# Altium project smartparks-elephant-lora.PrjPCB
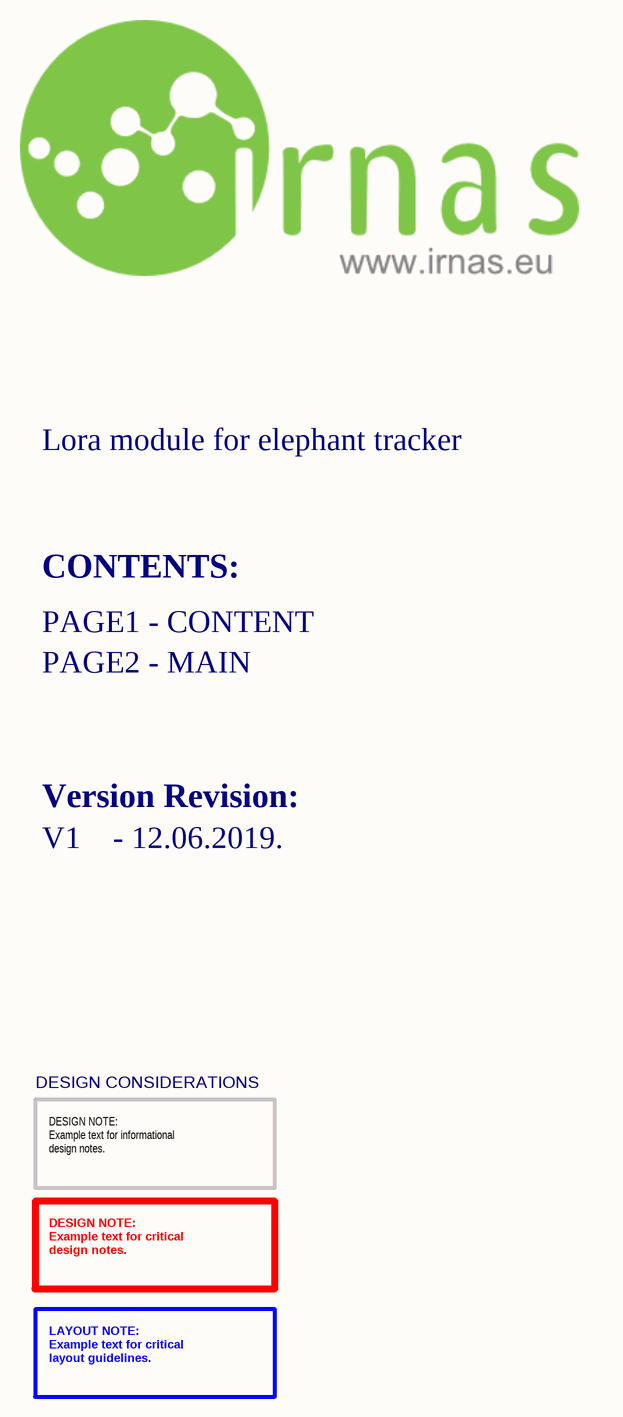
[diagram p0: PAGE1-CONTENT.SchDoc]
Company: IRNAS; CreateDate: dd.mm.yyyy; PCBDesigner: Vojislav Milivojevic; ProjectTitle: SmartParks Elephant LoRa; RevisionDate: dd.mm.yyyy; Version: V1; Website: www.irnas.eu
2 sheets, 40 parts. Net scope: global (net labels, ports and power ports of the same name join across sheets).
Board file: MAIN.PcbDoc
Sheets:
  PAGE1-CONTENT.SchDoc
  PAGE2-MAIN.SchDoc

## Sheet PAGE1-CONTENT.SchDoc
size A3; DocumentNumber: 1; SheetNumber: 1; SheetTotal: 2

### Notes on the sheet
- Lora module for elephant tracker
- CONTENTS:
- PAGE1 - CONTENT
- PAGE2 - MAIN
- Version Revision:
- V1    - 12.06.2019.
- DESIGN CONSIDERATIONS
- DESIGN NOTE:
  Example text for informational
  design notes.
- DESIGN NOTE:
  Example text for critical
  design notes.
- LAYOUT NOTE:
  Example text for critical
  layout guidelines.
- Size: A3
- Revision:
- Sheet
- of

## Sheet PAGE2-MAIN.SchDoc
size A3; DocumentNumber: 2; SheetNumber: 2; SheetTotal: 2
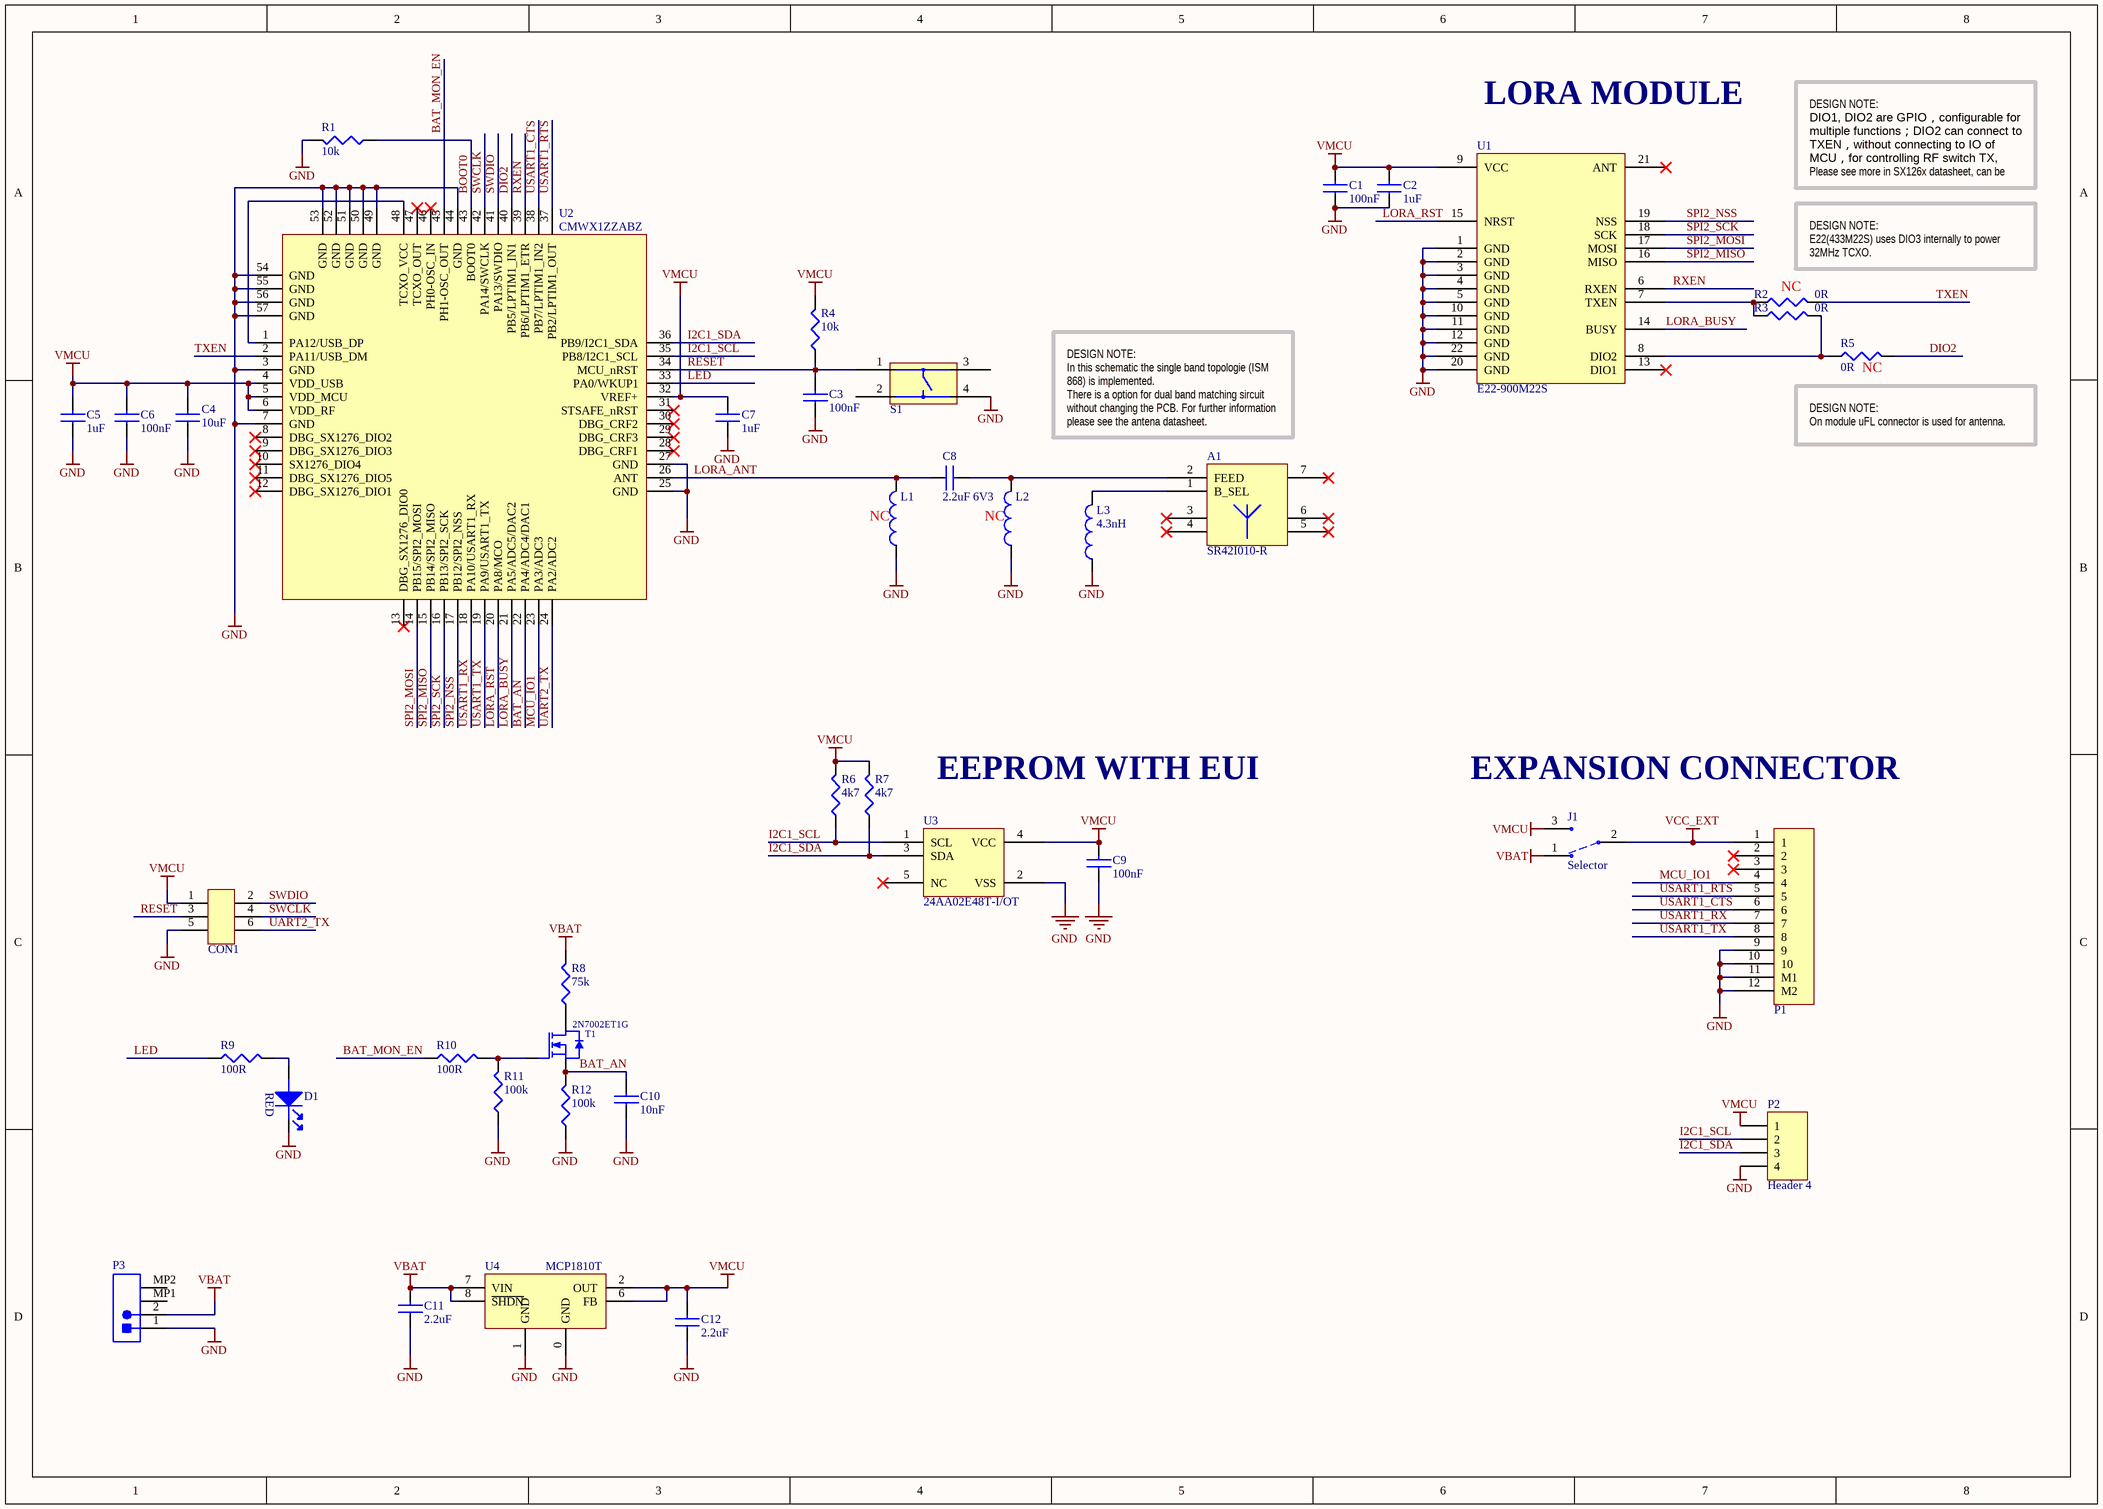
[diagram p1: PAGE2-MAIN.SchDoc]

### Parts
A1  SR42I010-R  [LORA_PCB_ANTENNA]
C1  100nF  [CAP0603]
C2  1uF  [CAP0603]
C3  100nF  [CAP0603]
C4  10uF  [CAP0603]
C5  1uF  [CAP0603]
C6  100nF  [CAP0603]
C7  1uF  [CAP0603]
C8  2.2uF 6V3  [CAP0402]
C9  100nF  [CAP0603]
C10  10nF  [CAP0603]
C11  2.2uF  [CAP0805]
C12  2.2uF  [CAP0805]
CON1  Tag connect  [TC2030-IDC-NL]  (value not drawn)  (no BOM)
D1  LED RED  [LED0603]  (value not drawn)
J1  Selector  [Selector]
L1  4.3nH  [IND0402]  (value not drawn)
L2  4.3nH  [IND0402]  (value not drawn)
L3  4.3nH  [IND0402]
P1  53261-1071  [53261-1071]  (value not drawn)
P2  Header 4  [HDR1X4]
P3  S2B-PH-SM4-TB(LF)(SN)  [JST- S2B-PH-SM4-TB(LF)(SN)-2_V]  (value not drawn)
R1  10k  [RES0603]
R2  0R  [RES0603]
R3  0R  [RES0603]
R4  10k  [RES0603]
R5  0R  [RES0603]
R6  4k7  [RES0603]
R7  4k7  [RES0603]
R8  75k  [RES0603]
R9  100R  [RES0603]
R10  100R  [RES0603]
R11  100k  [RES0603]
R12  100k  [RES0603]
S1  KMR221NGLFS  [SW]  (value not drawn)
T1  2N7002ET1G  [SOT23-3AL]
U1  E22-900M22S  [E22-900M22S]
U2  CMWX1ZZABZ  [Lora Module ES0]
U3  24AA02E48T-I/OT  [SOT95P280X145-5N]
U4  MCP1810T  [VDFN_2x2]

### Nets
GND: C1.1 C2.1 C3.1 C4.1 C5.1 C6.1 C7.1 C9.1 C10.1 C11.1 C12.1 CON1.5 D1.1(cathode) L1.1 L2.1 L3.1 P1.9 P1.10 P1.11(M1) P1.12(M2) P2.4 P3.1 R1.2 R11.1 R12.1 S1.4 U1.1(GND) U1.2(GND) U1.3(GND) U1.4(GND) U1.5(GND) U1.10(GND) U1.11(GND) U1.12(GND) U1.20(GND) U1.22(GND) U2.3(GND) U2.7(GND) U2.25(GND) U2.27(GND) U2.44(GND) U2.49(GND) U2.50(GND) U2.51(GND) U2.52(GND) U2.53(GND) U2.54(GND) U2.55(GND) U2.56(GND) U2.57(GND) U3.2(VSS) U4.0(GND) U4.1(GND)
VBAT: C11.2 J1.1 P3.2 R8.2 U4.7(VIN) U4.8(~{SHDN})
VCC_EXT: J1.2 P1.1
VMCU: C1.2 C2.2 C4.2 C5.2 C6.2 C7.2 C9.2 C12.2 CON1.1 J1.3 P2.1 R4.2 R6.2 R7.2 U1.9(VCC) U2.4(VDD_USB) U2.5(VDD_MCU) U2.6(VDD_RF) U2.32(VREF+) U3.4(VCC) U4.2(OUT) U4.6(FB)
BAT_AN: C10.2 R12.2 T1.2(S) U2.22(PA4/ADC4/DAC1)
BAT_MON_EN: R10.1 U2.45(PH1-OSC_OUT)
BOOT0: R1.1 U2.43(BOOT0)
DIO2: R5.2 U2.40(PB5/LPTIM1_IN1)
I2C1_SCL: P2.2 R6.1 U2.35(PB8/I2C1_SCL) U3.1(SCL)
I2C1_SDA: P2.3 R7.1 U2.36(PB9/I2C1_SDA) U3.3(SDA)
LED: R9.1 U2.33(PA0/WKUP1)
LORA_ANT: C8.1 L1.2 U2.26(ANT)
LORA_BUSY: U1.14(BUSY) U2.21(PA5/ADC5/DAC2)
LORA_RST: U1.15(NRST) U2.20(PA8/MCO)
MCU_IO1: P1.4 U2.23(PA3/ADC3)
RESET: C3.2 CON1.3 R4.1 S1.1 U2.34(MCU_nRST)
RXEN: U1.6(RXEN) U2.39(PB6/LPTIM1_ETR)
SPI2_MISO: U1.16(MISO) U2.15(PB14/SPI2_MISO)
SPI2_MOSI: U1.17(MOSI) U2.14(PB15/SPI2_MOSI)
SPI2_NSS: U1.19(NSS) U2.17(PB12/SPI2_NSS)
SPI2_SCK: U1.18(SCK) U2.16(PB13/SPI2_SCK)
SWCLK: CON1.4 U2.42(PA14/SWCLK)
SWDIO: CON1.2 U2.41(PA13/SWDIO)
TXEN: R2.2 U2.2(PA11/USB_DM)
UART2_TX: CON1.6 U2.24(PA2/ADC2)
USART1_CTS: P1.6 U2.38(PB7/LPTIM1_IN2)
USART1_RTS: P1.5 U2.37(PB2/LPTIM1_OUT)
USART1_RX: P1.7 U2.18(PA10/USART1_RX)
USART1_TX: P1.8 U2.19(PA9/USART1_TX)
NetA1_1: A1.1(B_SEL) L3.2
NetA1_2: A1.2(FEED) C8.2 L2.2
NetD1_2: D1.2(ANODE) R9.2
NetR2_1: R2.1 R3.1 U1.7(TXEN)
NetR3_2: R3.2 R5.1 U1.8(DIO2)
NetR8_1: R8.1 T1.3(D)
NetR10_2: R10.2 R11.2 T1.1(G)
NetU2_1: U2.1(PA12/USB_DP) U2.48(TCXO_VCC)

Not connected (* = marked no-connect by the designer): A1 3* 4* 5* 6* 7*; P1 2* 3*; P3 MP1 MP2; S1 2 3; U1 13(DIO1)* 21(ANT)*; U2 8(DBG_SX1276_DIO2)* 9(DBG_SX1276_DIO3)* 10(SX1276_DIO4)* 11(DBG_SX1276_DIO5)* 12(DBG_SX1276_DIO1)* 13(DBG_SX1276_DIO0)* 28(DBG_CRF1)* 29(DBG_CRF3)* 30(DBG_CRF2)* 31(STSAFE_nRST)* 46(PH0-OSC_IN)* 47(TCXO_OUT)*; U3 5(NC)*

### Notes on the sheet
- LORA MODULE
- DESIGN NOTE:
  DIO1, DIO2 are GPIO，configurable for multiple functions；DIO2 can connect to TXEN，without connecting to IO of MCU，for controlling RF switch TX, Please see more in SX126x datasheet, can be floated when free.
- (near R2) NC
- DESIGN NOTE:
  E22(433M22S) uses DIO3 internally to power 32MHz TCXO.
- (near R5) NC
- DESIGN NOTE:
  In this schematic the single band topologie (ISM 868) is implemented.
  There is a option for dual band matching sircuit without changing the PCB. For further information please see the antena datasheet.
- (near R5) DESIGN NOTE:
  On module uFL connector is used for antenna.
- (near L1) NC
- (near L2) NC
- EEPROM WITH EUI
- EXPANSION CONNECTOR
- (in symbol LED - LED RED) RED

### Library data of the parts
A1 = SR42I010-R: Antenna SMD -4dBi Gain 870MHz/928MHz Automotive 7-Pin SMD T/R; Manufacturer: Antenova; Supplier 1: Mouser; Manufacturer Part Number: SR42I010-R; Stock 1: 3154; Pricing 1: 1 = 2.36000, 10 = 1.90000, 50 = 1.90000, 100 = 1.52000, 1000 = 1.07000, 10000 = 0.95900 (USD); Supplier Part Number 1: 237-SR42I010-R
C1 C3 C6 C9 = C - 100nF: MURATA - GRM188R71C104KA01J - CAP, MLCC, X7R, 0.1UF, 16V, 0603; IRNAS Part No.: I-200005; Ceramic Capacitor Case: 0603 [1608 Metric]; Capacitance: 0.1; Voltage Rating: 16; Capacitance Tolerance: ± 10%; Dielectric Characteristic: X7; Product Range: GRM Series; SVHC: No SVHC (20-Jun-2016; Supplier 1: Farnell; Manufacturer: MURATA; Manufacturer Part Number: GRM188R71C104KA01J; RoHS: YES; Stock 1: 18297; Pricing 1: 10=0.0145, 100=0.0126, 500=0.0081, 2500=0.0059, 5000=0.0052, 10000=0.0046, 50000=0.0036, 100000=0.0035 (GBP); Packaging: Cut Tape; Operating Temperature Min: -55; Operating Temperature Max: 125; Automotive Qualification Standard: -; MSL: MSL 1 - Unlimited; ComponentLink1URL: http://www.farnell.com/datasheets/2189124.pdf; ComponentLink1Description: http://www.farnell.com/datasheets/2189124.pdf; Supplier Part Number 1: 2688519
C2 C5 C7 = C - 1uF: MURATA - GRM188R61H105KAALD - CAP, MLCC, X5R, 1UF, 50V, 0603; IRNAS Part No.: I-200006; Ceramic Capacitor Case: 0603 [1608 Metric]; Capacitance: 1; Voltage Rating: 50; Capacitance Tolerance: ± 10%; Dielectric Characteristic: X5; Product Range: GRM Series; SVHC: No SVHC (17-Dec-2015); Capacitor Terminals: SMD<!--FANDB--><div class="features-and-benefits-container"><div class="features-and-benefits-description"><span class="features-benefits-value">The Murata GRM series capacitors are Multilayer Ceramic Chip Capacitors (MLCC) used for general purpose applications. These MLCC capacitors are classified into temperature compensating and high dielectric constant types depending on the change in electrostatic capacitance due to change in temperature. The temperature compensating capacitors feature a small rate of change in electrostatic capacitance as the temperature changes and are used for applications such as filters and high frequency circuit matching. The high dielectric constant capacitors use materials with a high dielectric constant and feature a large electrostatic capacitance. Typical applications are power supply decoupling and smoothing circuits.</span></div><div class="features-and-benefits-list"><ul class="features-and-benefits-list-list"><li class="features-and-benefits-list-item">Large capacity and small size in a multilayer structure</li><li class="features-and-benefits-list-item">Capacitance value ranging from 0.1pF to 220?F</li><li class="features-and-benefits-list-item">Tin plated external electrodes, excellent solderability</li><li class="features-and-benefits-list-item">Provides good high frequency characteristics</li><li class="features-and-benefits-list-item">Excellent pulse response</li><li class="features-and-benefits-list-item">High reliability</li><li class="features-and-benefits-list-item">Capacitor size varies from 0.4×0.2mm to 5.7×5.0mm</li><li class="features-and-benefits-list-item">Rated voltage of 2.5VDC to 3.15; Supplier 1: Farnell; Manufacturer: MURATA; Manufacturer Part Number: GRM188R61H105KAALD; RoHS: YES; Stock 1: 62682; Pricing 1: 10=0.093, 100=0.062, 500=0.0507, 1000=0.0465, 2000=0.0429, 4000=0.0399, 20000=0.0372, 40000=0.0365 (GBP); Packaging: Cut Tape; Operating Temperature Min: -55; Operating Temperature Max: 85; Automotive Qualification Standard: -; MSL: -; Capacitance Tolerance ±: ± 10%; ComponentLink1URL: http://www.farnell.com/datasheets/2048611.pdf; ComponentLink1Description: http://www.farnell.com/datasheets/2048611.pdf; Supplier Part Number 1: 1845736
C4 = 10uF: 10uf/0603/20%; Manufacturer: KEMET; Manufacturer Part Number: C0603C106M8PACTU; Stock 1: 0; Pricing 1: 10=0.555, 100=0.315, 500=0.238, 1000=0.2, 2000=0.174, 4000=0.143, 20000=0.123 (GBP); Supplier 1: Farnell; Supplier Part Number 1: 2456110
C8 = C - 2.2uF/6V3/0402: CAP CER 2.2UF 6.3V 20% X5R 0402; Manufacturer: Murata; Manufacturer Part Number: GRM155R60J225ME15D; IRNAS Part No.: /; Material: Ceramic; Supplier 1: Farnell; Stock 1: 0; Pricing 1: 10=0.118, 100=0.0494, 500=0.031, 2500=0.0213, 5000=0.0163 (EUR); Mount: Surface Mount; Case/Package: 0402; Case Code (Metric): 1005; Case Code (Imperial): 0402; Min Operating Temperature: -55°C; Max Operating Temperature: 85°C; Packaging: Tape and Reel; Capacitance: 2.2uF; Tolerance: 20%; Package Quantity: 10000; Voltage Rating: 6.3V; Voltage Rating (DC): 6.3V; Dielectric: X5R; Termination: SMD/SMT; Voltage: 6.3V; Length: 1mm; Height: 0.5mm; Width: 0.02inch; Thickness: 0.022inch; Depth: 0.5mm; Radiation Hardening: No; REACH SVHC: No SVHC; Lead Free: Lead Free; ComponentLink1URL: https://datasheet.ciiva.com/29149/450128-da-01-de-vs-kondens-grm155-r60j-225me15d-29149006.pdf; ComponentLink1Description: https://datasheet.ciiva.com/29149/450128-da-01-de-vs-kondens-grm155-r60j-225me15d-29149006.pdf; ComponentLink2URL: https://datasheet.ciiva.com/46418/1754686-46418042.pdf; ComponentLink2Description: https://datasheet.ciiva.com/46418/1754686-46418042.pdf; ComponentLink3URL: https://datasheet.ciiva.com/17454/c02e-17454956.pdf; ComponentLink3Description: https://datasheet.ciiva.com/17454/c02e-17454956.pdf; ComponentLink4URL: https://datasheet.ciiva.com/235/partnumbering-e-01-235009.pdf; ComponentLink4Description: https://datasheet.ciiva.com/235/partnumbering-e-01-235009.pdf; ComponentLink5URL: https://datasheet.ciiva.com/2989/c02e-2989361.pdf; ComponentLink5Description: https://datasheet.ciiva.com/2989/c02e-2989361.pdf; ComponentLink6URL: https://datasheet.ciiva.com/235/partnumbering-e-01-235010.pdf; ComponentLink6Description: https://datasheet.ciiva.com/235/partnumbering-e-01-235010.pdf; ComponentLink7URL: https://datasheet.ciiva.com/235/partnumbering-e-01-235011.pdf; ComponentLink7Description: https://datasheet.ciiva.com/235/partnumbering-e-01-235011.pdf; Supplier Part Number 1: 2362088
C10 = C - 10nF: KEMET - C0603X103K5RECAUTO - CAP, MLCC, AEC-Q200, X7R, 0.01UF, 50V; Manufacturer: TDK EPCOS; IRNAS Part No.: I-200004; Supplier 1: Farnell; Manufacturer Part Number: C0603X103K5RECAUTO; Stock 1: 307350; Pricing 1: 10=0.133, 100=0.0731, 500=0.055, 1000=0.0465, 2000=0.0408, 4000=0.0336, 20000=0.0295 (GBP); ComponentLink1URL: http://www.farnell.com/datasheets/2290180.pdf; ComponentLink1Description: http://www.farnell.com/datasheets/2290180.pdf; Supplier Part Number 1: 2760492
C11 C12 = C - 2.2uF/0805: Multilayer Ceramic Capacitors MLCC - SMD/SMT 2.2uF 25V X7R 10%; Manufacturer: Yageo; Manufacturer Part Number: CC0805KKX7R8BB225; IRNAS Part No.: /; Supplier 1: Farnell; Stock 1: 0; Pricing 1: 5=0.269, 50=0.163, 250=0.109, 500=0.0929, 1500=0.0722, 3000=0.0594, 15000=0.05 (GBP); Mount: Surface Mount; Case/Package: 0805; Number of Pins: 2; Case Code (Imperial): 0805; Case Code (Metric): 2012; Min Operating Temperature: -55°C; Max Operating Temperature: 125°C; Packaging: Tape and Reel; Voltage Rating: 25V; Voltage Rating (DC): 25V; Tolerance: 10%; Capacitance: 2.2uF; Dielectric: X7R; Termination: SMD/SMT; Composition: Ceramic; Length: 2mm; Height: 0.3mm; Depth: 1.25mm; Width: 1.25mm; Thickness: 0.057inch; Radiation Hardening: No; REACH SVHC: Unknown; Lead Free: Lead Free; Halogen Free: Halogen Free; ComponentLink1URL: https://datasheet.ciiva.com/7009/775840-7009706.pdf; ComponentLink1Description: https://datasheet.ciiva.com/7009/775840-7009706.pdf; Supplier Part Number 1: 1458904
CON1 = tag connecot 6 pin
D1 = LED - LED RED: BROADCOM LIMITED - HSMS-C190 - LED, RED, 10MCD, 626NM; LED Mounting: SMD; Forward Current If: 20; Forward Voltage: 2.1; Wavelength Typ: 626; Luminous Intensity: 10; Viewing Angle: 170°; Lens Shape: Rectangular; SVHC: No SVHC (17-Dec-2015)<!--FANDB--><div class="features-and-benefits-container"><div class="features-and-benefits-description"><span class="features-benefits-value">The HSMS-C190 is a HER SMD Chip LED with untinted/diffused lens, made of GaP. It is designed in an industry standard package 1.6 x 0.8mm footprint with 0.8mm profile. It is compatible with IR reflow solder processes. The small size and wide viewing angle make this LED prime choices for backlighting applications and front panel illumination especially where space is a premium.</span></div><div class="features-and-benefits-list"><ul class="features-and-benefits-list-list"><li class="features-and-benefits-list-item">Small size</li><li class="features-and-benefits-list-item">Industry standard footprint</li><li class="features-and-benefits-list-item">Compatible with IR solder</li><li class="features-and-benefits-list-item">Diffused optics</li><li class="features-and-benefits-list-item">-40 to 85; Supplier 1: Farnell; Manufacturer: BROADCOM LIMITED; Manufacturer Part Number: HSMS-C190; RoHS: YES; Stock 1: 7534; Pricing 1: 1=0.361, 10=0.256, 50=0.235, 100=0.106, 200=0.101 (GBP); LED Colour: Red; Bulb Size: -; Packaging: Cut Tape; Product Range: -; Automotive Qualification Standard: -; MSL: -; ComponentLink1URL: http://www.farnell.com/datasheets/313031.pdf; ComponentLink1Description: http://www.farnell.com/datasheets/313031.pdf; ComponentLink2URL: http://www.farnell.com/datasheets/1681524.pdf; ComponentLink2Description: http://www.farnell.com/datasheets/1681524.pdf; ComponentLink3URL: http://www.farnell.com/datasheets/2165483.pdf; ComponentLink3Description: http://www.farnell.com/datasheets/2165483.pdf; Supplier Part Number 1: 2497356
L1 L2 = L - 4.3nH/0402: Inductor RF Chip Multi-Layer 4.3nH 0.3nH 100MHz 8Q-Factor Air 300mA 210mOhm DCR 0402 Paper T/R; Manufacturer: Murata; Manufacturer Part Number: LQG15HN4N3S02D; IRNAS Part No.: /; Q Factor: 8; Self Resonant Frequency: 6GHz; Shielding: Unshielded; DC Resistance (DCR): 210mR; Supplier 1: Digi-Key; Stock 1: 3502; Pricing 1: 1 = 0.10000, 10 = 0.06100, 100 = 0.04040, 500 = 0.03366, 1000 = 0.02827, 2500 = 0.02423 (USD); RoHS: Yes; Mount: Surface Mount; Case/Package: 0402; Core Material: Air; Case Code (Metric): 1005; Case Code (Imperial): 0402; Min Operating Temperature: -55°C; Max Operating Temperature: 125°C; Package Quantity: 10000; Packaging: Tape and Reel; Current Rating: 300mA; Inductance: 4.3nh; Test Frequency: 100MHz; Max DC Current: 300mA; Termination: SMD/SMT; Current: 300mA; DC Current: 300mA; Military Standard: Not; Length: 1.05mm; Height: 0.5mm; Width: 0.02inch; Height - Seated (Max): 0.022inch; Depth: 0.55mm; Radiation Hardening: No; REACH SVHC: No SVHC; Lead Free: Lead Free; ComponentLink1URL: http://uk.rs-online.com/webdocs/0f10/0900766b80f10808.pdf?src-supplier=RSComponents; ComponentLink1Description: http://uk.rs-online.com/webdocs/0f10/0900766b80f10808.pdf?src-supplier=RSComponents; ComponentLink2URL: http://search.murata.co.jp/Ceramy/image/img/PDF/ENG/L0075S0083LQG15HN.pdf?src-supplier=Avnet; ComponentLink2Description: http://search.murata.co.jp/Ceramy/image/img/PDF/ENG/L0075S0083LQG15HN.pdf?src-supplier=Avnet; ComponentLink3URL: http://www.farnell.com/datasheets/66026.pdf?src-supplier=Element14; ComponentLink3Description: http://www.farnell.com/datasheets/66026.pdf?src-supplier=Element14; ComponentLink4URL: https://www.verical.com/server-webapp/html/getDatasheet?partID=31252&src-supplier=Verical; ComponentLink4Description: https://www.verical.com/server-webapp/html/getDatasheet?partID=31252&src-supplier=Verical; ComponentLink5URL: http://search.murata.co.jp/Ceramy/image/img/PDF/ENG/L0075S0083LQG15HN.pdf?src-supplier=Avnet+Europe; ComponentLink5Description: http://search.murata.co.jp/Ceramy/image/img/PDF/ENG/L0075S0083LQG15HN.pdf?src-supplier=Avnet+Europe; ComponentLink6URL: https://search.murata.co.jp/Ceramy/image/img/P02/partnumberingAT_LQ3E.pdf?src-supplier=Digi-Key; ComponentLink6Description: https://search.murata.co.jp/Ceramy/image/img/P02/partnumberingAT_LQ3E.pdf?src-supplier=Digi-Key; Supplier Part Number 1: 490-6563-1-ND
L3 = 4.3nH/0402: Inductor RF Chip Multi-Layer 4.3nH 0.3nH 100MHz 8Q-Factor Air 300mA 210mOhm DCR 0402 Paper T/R; Manufacturer: Murata; Manufacturer Part Number: LQG15HN4N3S02D; Q Factor: 8; Self Resonant Frequency: 6GHz; Shielding: Unshielded; DC Resistance (DCR): 210mR; Supplier 1: Digi-Key; Stock 1: 3502; Pricing 1: 1 = 0.10000, 10 = 0.06100, 100 = 0.04040, 500 = 0.03366, 1000 = 0.02827, 2500 = 0.02423 (USD); RoHS: Yes; Mount: Surface Mount; Case/Package: 0402; Core Material: Air; Case Code (Metric): 1005; Case Code (Imperial): 0402; Min Operating Temperature: -55°C; Max Operating Temperature: 125°C; Package Quantity: 10000; Packaging: Tape and Reel; Current Rating: 300mA; Inductance: 4.3nh; Test Frequency: 100MHz; Max DC Current: 300mA; Termination: SMD/SMT; Current: 300mA; DC Current: 300mA; Military Standard: Not; Length: 1.05mm; Height: 0.5mm; Width: 0.02inch; Height - Seated (Max): 0.022inch; Depth: 0.55mm; Radiation Hardening: No; REACH SVHC: No SVHC; Lead Free: Lead Free; ComponentLink1URL: http://uk.rs-online.com/webdocs/0f10/0900766b80f10808.pdf?src-supplier=RSComponents; ComponentLink1Description: http://uk.rs-online.com/webdocs/0f10/0900766b80f10808.pdf?src-supplier=RSComponents; ComponentLink2URL: http://search.murata.co.jp/Ceramy/image/img/PDF/ENG/L0075S0083LQG15HN.pdf?src-supplier=Avnet; ComponentLink2Description: http://search.murata.co.jp/Ceramy/image/img/PDF/ENG/L0075S0083LQG15HN.pdf?src-supplier=Avnet; ComponentLink3URL: http://www.farnell.com/datasheets/66026.pdf?src-supplier=Element14; ComponentLink3Description: http://www.farnell.com/datasheets/66026.pdf?src-supplier=Element14; ComponentLink4URL: https://www.verical.com/server-webapp/html/getDatasheet?partID=31252&src-supplier=Verical; ComponentLink4Description: https://www.verical.com/server-webapp/html/getDatasheet?partID=31252&src-supplier=Verical; ComponentLink5URL: http://search.murata.co.jp/Ceramy/image/img/PDF/ENG/L0075S0083LQG15HN.pdf?src-supplier=Avnet+Europe; ComponentLink5Description: http://search.murata.co.jp/Ceramy/image/img/PDF/ENG/L0075S0083LQG15HN.pdf?src-supplier=Avnet+Europe; ComponentLink6URL: https://search.murata.co.jp/Ceramy/image/img/P02/partnumberingAT_LQ3E.pdf?src-supplier=Digi-Key; ComponentLink6Description: https://search.murata.co.jp/Ceramy/image/img/P02/partnumberingAT_LQ3E.pdf?src-supplier=Digi-Key; Supplier Part Number 1: 490-6563-1-ND
P1 = 53261-1071: Headers & Wire Housings 1.25MM HDR 10 CKT Right-Angle; Manufacturer: Molex; Contact Resistance: 20mR; Number of Positions: 10; Gender: Male; Voltage Rating: 125V; Current Rating: 1A; Insulation Resistance: 100MR; Glow Wire Compliant: Non-compliant; Supplier 1: Digi-Key; Manufacturer Part Number: 53261-1071; Stock 1: 12832; Pricing 1: 1 = 1.88000, 10 = 1.70200, 100 = 1.45900, 500 = 1.21584 (USD); RoHS: Yes; Mount: Surface Mount; Contact Plating: Tin; Contact Material: Bronze; Housing Material: Thermoplastic; Min Operating Temperature: -40°C; Max Operating Temperature: 85°C; Packaging: Tape and Reel; Orientation: Right Angle; Package Quantity: 1000; Termination: SMD/SMT; Number of Rows: 1; Number of Contacts: 10; Voltage Rating (DC): 125V; Number of Circuits: 10; Pitch: 1.25mm; Radiation Hardening: No; Lead Free: Lead Free; Flammability Rating: UL94 V-0; REACH SVHC: Unknown; ComponentLink1URL: https://datasheet.ciiva.com/7167/1626154-7167504.pdf?src-supplier=Newark; ComponentLink1Description: https://datasheet.ciiva.com/7167/1626154-7167504.pdf?src-supplier=Newark; ComponentLink2URL: https://datasheet.ciiva.com/5154/0532611071-pcb-headers-256967-5154836.pdf?src-supplier=Mouser; ComponentLink2Description: https://datasheet.ciiva.com/5154/0532611071-pcb-headers-256967-5154836.pdf?src-supplier=Mouser; ComponentLink3URL: https://datasheet.ciiva.com/7810/1597313-7810535.pdf?src-supplier=Element14; ComponentLink3Description: https://datasheet.ciiva.com/7810/1597313-7810535.pdf?src-supplier=Element14; ComponentLink4URL: https://datasheet.ciiva.com/27055/1932598-27055000.pdf?src-supplier=Jameco; ComponentLink4Description: https://datasheet.ciiva.com/27055/1932598-27055000.pdf?src-supplier=Jameco; ComponentLink5URL: https://datasheet.ciiva.com/11747/0900766b8078fc91-11747290.pdf?src-supplier=RSComponents; ComponentLink5Description: https://datasheet.ciiva.com/11747/0900766b8078fc91-11747290.pdf?src-supplier=RSComponents; ComponentLink6URL: https://datasheet.ciiva.com/46440/1808533-46440933.pdf?src-supplier=Element14; ComponentLink6Description: https://datasheet.ciiva.com/46440/1808533-46440933.pdf?src-supplier=Element14; ComponentLink7URL: https://datasheet.ciiva.com/46440/1626154-46440951.pdf?src-supplier=Element14; ComponentLink7Description: https://datasheet.ciiva.com/46440/1626154-46440951.pdf?src-supplier=Element14; Supplier Part Number 1: WM7628CT-ND
P2 = Header 4: Header, 4-Pin; LatestRevisionDate: 17-Jul-2002; LatestRevisionNote: Re-released for DXP Platform.; Publisher: Altium Limited
P3 = CMP-1755-00001-1: Male Header, Pitch 2 mm, 1 x 2 Position, Height 5.5 mm, -25 to 85 degC, RoHS, Tape and Reel; Current Rating: 3 A; ComponentLink1URL: http://www.jst.com/home2.html; Radiation Hardening: No; RoHSCompliant: True; Mount: Through Hole; Contact Material: Bronze; Package Quantity: 100; Width: 2.34 mm; DatasheetVersion: Dec-12; Height: 8.13 mm; Max Operating Temperature: 105degC; ComponentLink2Description: Datasheet; Lead Pitch: 0.1 inch; Contact Finish: Lead; Packaging: Bulk; Colour: Black; Contact Plating: Tin; Min Operating Temperature: -65degC; ComponentLink1Description: Manufacturer URL; PackageReference: S2B-PH-SM4-TB(LF)(SN)-2; PackageDescription: Male Header, Pitch 2 mm, 1 x 2 Position, Height 5.5 mm; ComponentLink2URL: http://www.jst-mfg.com/product/pdf/eng/ePH.pdf; Pins: 40; Length: 101.19 mm
R1 R4 = R - 10k: MULTICOMP - MCMR06X103 JTL - RES, CERAMIC, 10K, 5%, 0.1W, 0603; IRNAS Part No.: I-100008; Resistance: 10; Voltage Rating: 75; Resistor Case Style: 0603 [1608 Metric]; Power Rating: 100; Product Range: MCMR Series; Temperature Coefficient: ± 100; Automotive Qualification Standard: -<!--FANDB--><div class="features-and-benefits-container"><div class="features-and-benefits-description"><span class="features-benefits-value">The Multicomp MCMR series resistors are automotive grade, anti sulphured thick film chip resistor. The resistance range includes E24 and E96 decade values from 1ohm to 10Mohm. These resistors are constructed on top of a high grade ceramic body.</span></div><div class="features-and-benefits-list"><ul class="features-and-benefits-list-list"><li class="features-and-benefits-list-item">EIA 0402, 0603, 0805, 1206 chip sizes available</li><li class="features-and-benefits-list-item">High reliability and stability</li><li class="features-and-benefits-list-item">Automotive grade AEC-Q200 compliant</li><li class="features-and-benefits-list-item">Complaint with (IEC 60068-1) 55/155/56 climatic category</li><li class="features-and-benefits-list-item">Maximum operation voltage of 50V, 75V, 150V and 200V</li><li class="features-and-benefits-list-item">Power rating of 62.5mW, 100mW, 125mW and 250mW</li><li class="features-and-benefits-list-item">Available in ±1% and ±5% tolerance</li><li class="features-and-benefits-list-item">Temperature coefficient (TCR) of +200ppm/°C, +100ppm/°C and -200ppm/°C to +400ppm/°C</li><li class="features-and-benefits-list-item">Operating temperature range -55°C to 155; Supplier 1: Farnell; Manufacturer: MULTICOMP; Manufacturer Part Number: MCMR06X103 JTL; RoHS: Y-EX; Stock 1: 19791; Pricing 1: 10=0.0087, 100=0.0074, 500=0.0061, 1000=0.0048, 2500=0.0032, 5000=0.0024, 25000=0.0016, 50000=0.0013 (GBP); Resistance Tolerance: ± 5%; Packaging: Cut Tape; Resistor Element Material: Ceramic; ComponentLink1URL: http://www.farnell.com/datasheets/1716707.pdf; ComponentLink1Description: http://www.farnell.com/datasheets/1716707.pdf; Supplier Part Number 1: 2073356
R2 R3 R5 = R - 0R: BOURNS - CR0603-J/-000ELF - RES, THICK FILM, 0R, 5%, 0.1W, 0603; IRNAS Part No.: I-100011; Resistance: 0; Voltage Rating: 50; Resistor Case Style: 0603 [1608 Metric]; Power Rating: 100; Product Range: CR Series; SVHC: No SVHC (17-Dec-2015); Resistor Mounting: Surface Mount Device<!--FANDB--><div class="features-and-benefits-container"><div class="features-and-benefits-description"><span class="features-benefits-value">The Bourns CR series are standard thick film chip resistors. These resistors provide flexibility of performance, space saving and low cost. The Resistance range includes E96 and E24 decade values from 1ohm to 10Mohm.</span></div><div class="features-and-benefits-list"><ul class="features-and-benefits-list-list"><li class="features-and-benefits-list-item">0201, 0402, 0603, 0805, 1206, 1210, 2010, 2512 standard case sizes available</li><li class="features-and-benefits-list-item">±1% and ±5% tolerance</li><li class="features-and-benefits-list-item">±100ppm/°C, ±200ppm/°C and ±250ppm/°C TCR values available</li><li class="features-and-benefits-list-item">Power rating selectable for 50mW, 63mW, 0.1W, 0.125W, 0.25W, 0.5W and 1W based on ordering</li><li class="features-and-benefits-list-item">Jumpers are available for all size</li><li class="features-and-benefits-list-item">3 layer termination process with nickel barrier prevents leaching & provides excellent solderability</li><li class="features-and-benefits-list-item">Suitable for all type of soldering processes</li><li class="features-and-benefits-list-item">Tight dimensional tolerances</li><li class="features-and-benefits-list-item">Maximum working voltage depends on case size</li><li class="features-and-benefits-list-item">Operating temperature of -55°C to +125°C(CR0201) and -55°C to +155; Supplier 1: Farnell; Manufacturer: BOURNS; Manufacturer Part Number: CR0603-J/-000ELF; RoHS: YES; Stock 1: 58200; Pricing 1: 10=0.0146, 250=0.0097, 1000=0.0073, 5000=0.0049, 12500=0.0042 (GBP); Resistance Tolerance: ± 5%; Packaging: Cut Tape; Resistor Element Material: Thick Film; Temperature Coefficient: -; Automotive Qualification Standard: -; MSL: MSL 1 - Unlimited; ComponentLink1URL: http://www.bourns.com/engineering/CHPREZTR/cr0603.stp; ComponentLink1Description: http://www.bourns.com/engineering/CHPREZTR/cr0603.stp; ComponentLink2URL: http://www.farnell.com/datasheets/2178762.pdf; ComponentLink2Description: http://www.farnell.com/datasheets/2178762.pdf; Supplier Part Number 1: 2008343
R6 R7 = R - 4k7: MULTICOMP - MCMR06X4701FTL - RES, CERAMIC, 4K7, 1%, 0.1W, 0603; IRNAS Part No.: I-100003; Resistance: 4.7; Voltage Rating: 75; Resistor Case Style: 0603 [1608 Metric]; Power Rating: 100; Product Range: MCMR Series; Temperature Coefficient: ± 100; SVHC: No SVHC (12-Jan-2017)<!--FANDB--><div class="features-and-benefits-container"><div class="features-and-benefits-description"><span class="features-benefits-value">The Multicomp MCMR series resistors are automotive grade, anti sulphured thick film chip resistor. The resistance range includes E24 and E96 decade values from 1ohm to 10Mohm. These resistors are constructed on top of a high grade ceramic body.</span></div><div class="features-and-benefits-list"><ul class="features-and-benefits-list-list"><li class="features-and-benefits-list-item">EIA 0402, 0603, 0805, 1206 chip sizes available</li><li class="features-and-benefits-list-item">High reliability and stability</li><li class="features-and-benefits-list-item">Automotive grade AEC-Q200 compliant</li><li class="features-and-benefits-list-item">Complaint with (IEC 60068-1) 55/155/56 climatic category</li><li class="features-and-benefits-list-item">Maximum operation voltage of 50V, 75V, 150V and 200V</li><li class="features-and-benefits-list-item">Power rating of 62.5mW, 100mW, 125mW and 250mW</li><li class="features-and-benefits-list-item">Available in ±1% and ±5% tolerance</li><li class="features-and-benefits-list-item">Temperature coefficient (TCR) of +200ppm/°C, +100ppm/°C and -200ppm/°C to +400ppm/°C</li><li class="features-and-benefits-list-item">Operating temperature range -55°C to 155; Supplier 1: Farnell; Manufacturer: MULTICOMP; Manufacturer Part Number: MCMR06X4701FTL; RoHS: Y-EX; Stock 1: 218618; Pricing 1: 10=0.0085, 100=0.0051, 500=0.0036, 1000=0.0028, 2500=0.0023 (GBP); Resistance Tolerance: ± 1%; Packaging: Cut Tape; Resistor Element Material: Ceramic; Automotive Qualification Standard: -; ComponentLink1URL: http://www.farnell.com/datasheets/1716707.pdf; ComponentLink1Description: http://www.farnell.com/datasheets/1716707.pdf; Supplier Part Number 1: 2073509
R8 = R - 75k: MULTICOMP - MCSR06X7502FTL - RES, CERAMIC, 75K, 1%, 0.1W, 0603; IRNAS Part No.: /; Supplier 1: Farnell; Manufacturer: MULTICOMP; Manufacturer Part Number: MCSR06X7502FTL; RoHS: Y-EX; Stock 1: 1882; Pricing 1: 10=0.0145, 100=0.0113, 500=0.008, 1000=0.0064, 2500=0.004, 5000=0.0031, 25000=0.0021, 50000=0.002 (GBP); ComponentLink1URL: http://www.farnell.com/datasheets/1716711.pdf; ComponentLink1Description: http://www.farnell.com/datasheets/1716711.pdf; Supplier Part Number 1: 2074304
R9 R10 = R - 100R: MULTICOMP - MC0063W06031100R - RES, THICK FILM, 100R, 1%, 0.063W, 0603; IRNAS Part No.: I-100009; Resistance: 100; Voltage Rating: 50; Resistor Case Style: 0603 [1608 Metric]; Power Rating: 63; Product Range: MC Series; Temperature Coefficient: ± 200; SVHC: No SVHC (12-Jan-2017); External Depth: 0.45; External Length / Height: 1.6; External Width: 0.8; No. of Pins: 2; Reel Quantity: 5000; Resistor Mounting: Surface Mount Device; Temperature Coeff. +: 200; Voltage Rating V DC: 50V<!--FANDB--><div class="features-and-benefits-container"><div class="features-and-benefits-description"><span class="features-benefits-value">The Multicomp MC series current sense resistors are thick film chip resistors. The resistance range includes E96 and E24 decade values from 1ohm to 10Mohm.</span></div><div class="features-and-benefits-list"><ul class="features-and-benefits-list-list"><li class="features-and-benefits-list-item">EIA 0402, 0603, 0805, 1206 chip sizes available</li><li class="features-and-benefits-list-item">Small size and low weight</li><li class="features-and-benefits-list-item">Suitable for both wave and reflow soldering</li><li class="features-and-benefits-list-item">Reduction of assembly costs</li><li class="features-and-benefits-list-item">Maximum working voltage of 50V(0402, 0603), 150V(0805), 200V(1206)</li><li class="features-and-benefits-list-item">Available in ±1%, ±2% and ±5% tolerance</li><li class="features-and-benefits-list-item">Power rating of 62.5mW, 100mW and 125mW</li><li class="features-and-benefits-list-item">±400ppm/°C(1ohm to 10ohm), ±200ppm/°C(11ohm to 100ohm), ±100; Supplier 1: Farnell; Manufacturer: MULTICOMP; Manufacturer Part Number: MC0063W06031100R; RoHS: Y-EX; Stock 1: 78152; Pricing 1: 10=0.0011, 100=0.001, 500=0.0009, 1000=0.0008, 2500=0.0007 (GBP); Resistance Tolerance: ± 1%; Packaging: Cut Tape; Resistor Element Material: Thick Film; Automotive Qualification Standard: -; Operating Temperature Max: 155; Operating Temperature Min: -55; Operating Temperature Range: -55°C to +155; Tape Width: 8; Temperature Coeff. -: 200; Tolerance +: 1%; Tolerance -: 1%; ComponentLink1URL: http://www.farnell.com/datasheets/1788326.pdf; ComponentLink1Description: http://www.farnell.com/datasheets/1788326.pdf; ComponentLink2URL: http://www.farnell.com/cad/1561149.zip; ComponentLink2Description: http://www.farnell.com/cad/1561149.zip; ComponentLink3URL: http://www.farnell.com/datasheets/2289252.pdf; ComponentLink3Description: http://www.farnell.com/datasheets/2289252.pdf; Supplier Part Number 1: 9330364
R11 R12 = R - 100k: MULTICOMP - MCMR06X104 JTL - RES, CERAMIC, 100K, 5%, 0.1W, 0603; IRNAS Part No.: I-100007; Resistance: 100; Voltage Rating: 75; Resistor Case Style: 0603 [1608 Metric]; Product Range: MCMR Series; Temperature Coefficient: ± 100; Resistor Mounting: Surface Mount Device<!--FANDB--><div class="features-and-benefits-container"><div class="features-and-benefits-description"><span class="features-benefits-value">The Multicomp MCMR series resistors are automotive grade, anti sulphured thick film chip resistor. The resistance range includes E24 and E96 decade values from 1ohm to 10Mohm. These resistors are constructed on top of a high grade ceramic body.</span></div><div class="features-and-benefits-list"><ul class="features-and-benefits-list-list"><li class="features-and-benefits-list-item">EIA 0402, 0603, 0805, 1206 chip sizes available</li><li class="features-and-benefits-list-item">High reliability and stability</li><li class="features-and-benefits-list-item">Automotive grade AEC-Q200 compliant</li><li class="features-and-benefits-list-item">Complaint with (IEC 60068-1) 55/155/56 climatic category</li><li class="features-and-benefits-list-item">Maximum operation voltage of 50V, 75V, 150V and 200V</li><li class="features-and-benefits-list-item">Power rating of 62.5mW, 100mW, 125mW and 250mW</li><li class="features-and-benefits-list-item">Available in ±1% and ±5% tolerance</li><li class="features-and-benefits-list-item">Temperature coefficient (TCR) of +200ppm/°C, +100ppm/°C and -200ppm/°C to +400ppm/°C</li><li class="features-and-benefits-list-item">Operating temperature range -55°C to 155; Supplier 1: Farnell; Manufacturer: MULTICOMP; Manufacturer Part Number: MCMR06X104 JTL; RoHS: Y-EX; Stock 1: 187; Pricing 1: 10=0.0109, 100=0.0085, 500=0.006, 1000=0.0048, 2500=0.004, 5000=0.003, 25000=0.002, 50000=0.0016 (GBP); Power Rating: 100; Resistance Tolerance: ± 5%; Packaging: Cut Tape; Resistor Element Material: Ceramic; Automotive Qualification Standard: -; ComponentLink1URL: http://www.farnell.com/datasheets/1716707.pdf; ComponentLink1Description: http://www.farnell.com/datasheets/1716707.pdf; Supplier Part Number 1: 2073357
S1 = KMR221NGLFS: SWITCH TACTILE SPST-NO 0.05A 32V; Manufacturer: ITT C&K; Mechanical Life: 200000Cycles; Throw Configuration: SPST; Operating Force: 2N; Max Current Rating: 50mA; Power Rating: 1W; Illumination Type: Non-Illuminated; Switch Travel: 0.25mm; Switch Function: Off-Mom; Actuator Type: Standard; Actuator Length: 0.5mm; Supplier 1: Farnell; Manufacturer Part Number: KMR221NGLFS; Stock 1: 3038; Pricing 1: 10 = 0.29100, 500 = 0.27600, 1000 = 0.21800, 5000 = 0.18500, 10000 = 0.18100 (GBP); RoHS: Yes; Mount: Surface Mount; Case/Package: SMD/SMT; Contact Material: Silver; Contact Plating: Silver; Min Operating Temperature: -40°C; Max Operating Temperature: 85°C; Voltage Rating (DC): 32V; Packaging: Tape and Reel; Package Quantity: 1; Max Voltage Rating (DC): 32V; Current Rating: 50mA; Termination: Gull Wing; Orientation: Straight; Length: 2.8mm; Depth: 4.6mm; Radiation Hardening: No; Lead Free: Lead Free; ComponentLink1URL: https://www.ckswitches.com/media/1479/kmr2.pdf?src-supplier=Digi-Key; ComponentLink1Description: https://www.ckswitches.com/media/1479/kmr2.pdf?src-supplier=Digi-Key; ComponentLink2URL: http://www.ck-components.com/14414/kmr2_9aug12.pdf/?src-supplier=Avnet+Europe; ComponentLink2Description: http://www.ck-components.com/14414/kmr2_9aug12.pdf/?src-supplier=Avnet+Europe; ComponentLink3URL: http://www1.futureelectronics.com/doc/C%20-%20K%20COMPONENTS/KMR221NGLFS.pdf?src-supplier=Future+Electronics; ComponentLink3Description: http://www1.futureelectronics.com/doc/C%20-%20K%20COMPONENTS/KMR221NGLFS.pdf?src-supplier=Future+Electronics; Supplier Part Number 1: 2845727
T1 = T_M - 2N7002ET1G: MOSFET Transistor, N Channel, 310 mA, 60 V, 0.86 ohm, 10 V, 1 V; ELRAD Id sifra / ELRAD Id No: 597778; Opis / Description: MOSFET BSS123       /N-Channel; Komp / Device: SMD; Value: BSS123; Velikost / Size: SOT23; FIT: 0.44; Author: Ciril Golob; ComponentLink1Description: Datasheet; ComponentLink1URL: C:\ELRADSVN\Altium_Library\Libraries\Active\Datasheet\2N7002ET1G.pdf; Date: 11.07.2018; ComponentLINK1Description: Datasheet; ComponentLINK2Description: Datasheet www; ComponentLINK1URL: c:\ELRADSVN\Altium_Library\Libraries\Active\Datasheet\BSS123.pdf; ComponentLINK2URL: http://www.onsemi.com/pub/Collateral/BSS123-D.PDF; Supplier 1: Farnell; Supplier Part Number 1: 2317616; Supplier 2: Mouser; Supplier Part Number 2: 863-2N7002ET1G
U2 = MCU - CMWX1ZZABZ: RF Module, FSK, OOK, LoRa, 4.8Kbps, 915MHz, -135.5dBm, 2.2V to 3.6V, I2C, SPI, UART, USB; Manufacturer: Murata; Manufacturer Part Number: CMWX1ZZABZ-091; Stock 1: 175; Pricing 1: 1=11.7, 5=11.06, 10=9.94, 50=9.54, 100=9.14, 250=8.05 (GBP); ComponentLink1Description: Datasheet; ComponentLink1URL: D:\altium\Altium_Library\Active\Datasheet\CMWX1ZZABZ.pdf; Supplier 1: Farnell; Supplier Part Number 1: 2802546; Supplier 2: Mouser; Supplier Part Number 2: 81-CMWX1ZZABZ-091
U3 = 24AA02E48T-I/OT: MICROCHIP   24AA02E48T-I/OT   EEPROM, EUI-48 Node Identity, 2 Kbit, 2 BLK (128K x 8bit), 400 kHz, I2C, SOT-23, 5 Pins; Interface: I2C,Serial; Access Time: 3500ns; Frequency: 400kHz; Max Supply Voltage: 5.5V; Min Supply Voltage: 1.7V; Nominal Supply Current: 3mA; Density: 2Kb; Operating Supply Voltage: 5V; Max Frequency: 100kHz; Supplier 1: Farnell; Manufacturer: Microchip; Manufacturer Part Number: 24AA02E48T-I/OT; Stock 1: 13638; Pricing 1: 1 = 0.17600, 10 = 0.17100, 25 = 0.16400, 50 = 0.16000, 100 = 0.15600 (GBP); RoHS: Yes; Mount: Surface Mount; Case/Package: SOT-23; Number of Pins: 5; Min Operating Temperature: -40°C; Max Operating Temperature: 85°C; Packaging: Tape and Reel; Package Quantity: 3000; Memory Type: EEPROM; Memory Size: 2Kb; Termination: SMD/SMT; Length: 3.1mm; Height: 1.3mm; Width: 1.8mm; Radiation Hardening: No; REACH SVHC: No SVHC; Lead Free: Lead Free; ComponentLink1URL: http://www.farnell.com/datasheets/1725195.pdf?src-supplier=Element14; ComponentLink1Description: http://www.farnell.com/datasheets/1725195.pdf?src-supplier=Element14; ComponentLink2URL: http://www.farnell.com/datasheets/631538.pdf?src-supplier=Element14; ComponentLink2Description: http://www.farnell.com/datasheets/631538.pdf?src-supplier=Element14; ComponentLink3URL: http://ww1.microchip.com/downloads/en/DeviceDoc/22124D.pdf?src-supplier=Avnet+Europe; ComponentLink3Description: http://ww1.microchip.com/downloads/en/DeviceDoc/22124D.pdf?src-supplier=Avnet+Europe; ComponentLink4URL: http://www.microchip.com/mymicrochip/filehandler.aspx?ddocname=en538826&src-supplier=Future+Electronics; ComponentLink4Description: http://www.microchip.com/mymicrochip/filehandler.aspx?ddocname=en538826&src-supplier=Future+Electronics; ComponentLink5URL: http://www.produktinfo.conrad.com/datenblaetter/650000-674999/651228-da-01-en-EEPROM_24AA02E48T_I_OT_SOT_23_5_MCP.pdf?src-supplier=Conrad; ComponentLink5Description: http://www.produktinfo.conrad.com/datenblaetter/650000-674999/651228-da-01-en-EEPROM_24AA02E48T_I_OT_SOT_23_5_MCP.pdf?src-supplier=Conrad; Supplier Part Number 1: 1688855
U4 = V_LIN - MCP1810T: LDO Voltage Regulator, Fixed, 2.5 V to 5.5 V in, 2.5 V/150 mA out, 380 mV drop; Manufacturer: ON SEMICONDUCTOR; Manufacturer Part Number: LM2596DSADJG; Topology: Buck (Step Down); Input Voltage Min: 4.5; Input Voltage Max: 45; No. of Outputs: 1; DC / DC Converter IC Case: TO-263; No. of Pins: 5; Output Current: 3; Output Voltage Min: 1.23; Output Voltage Max: 37; Switching Frequency: 150; SVHC: No SVHC (12-Jan-2017; RoHS: YES; Stock 1: 342; Pricing 1: 1=1.98, 10=1.49, 100=1.19, 500=1.04, 1000=0.859, 2500=0.785 (GBP); Operating Temperature Max: 125; Packaging: Each; Product Range: -; Automotive Qualification Standard: -; MSL: MSL 1 - Unlimited; Supplier 1: Farnell; Supplier 2: Mouser; Supplier 3: Digi-Key; Supplier Part Number 1: 2678432; Supplier Part Number 2: 579-MCP1810T-25I/J8A; Supplier Part Number 3: MCP1810T-25I/J8ADKR-ND
U1 = E22-900M22S: ComponentLink1Description: Datasheet; ComponentLink1URL: http://www.ebyte.com/en/downpdf.aspx?id=437

## Assembly variants
BASIC: all parts fitted